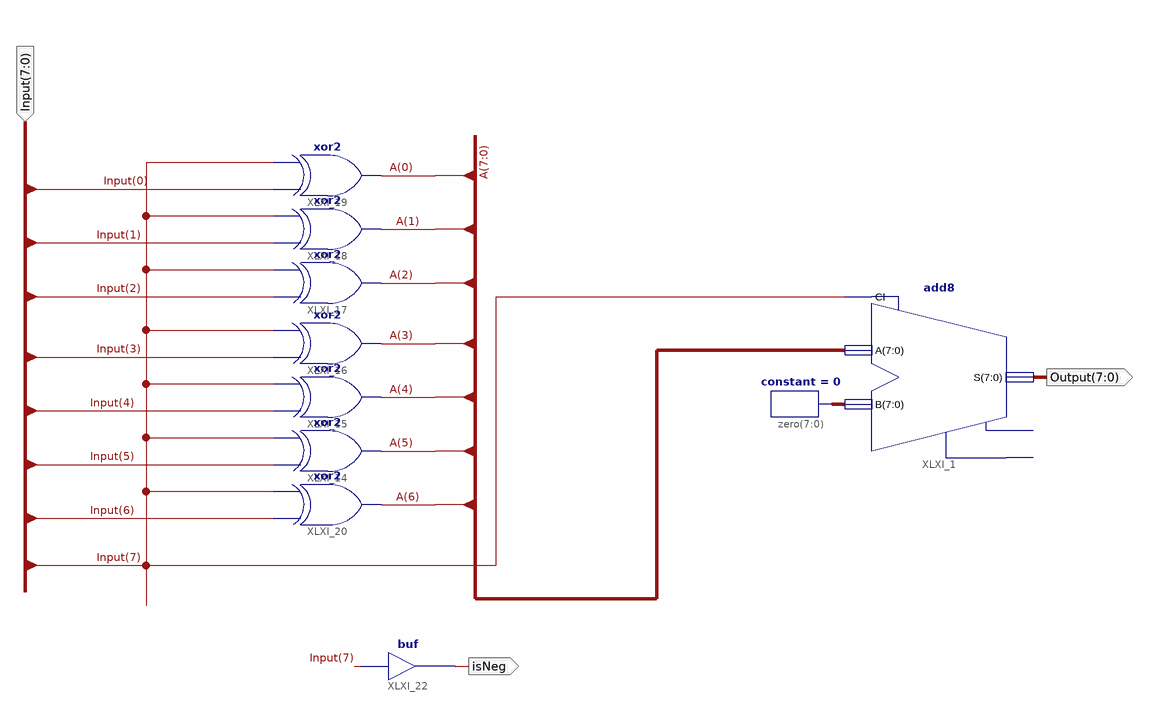
[diagram p0: schematic sheet 1]
// Xilinx ISE schematic twosComp.sch (spartan3e) as structural Verilog: 10 symbols, 3 ports
module twosComp (
  input  [7:0] Input,
  output [7:0] Output,
  output isNeg
);

  wire [7:0] A, XLXN_4;

  constant #(.CValue("0")) zero[7:0] (.O(XLXN_4));
  xor XLXI_14 (A[5], Input[5], Input[7]);
  xor XLXI_15 (A[4], Input[4], Input[7]);
  xor XLXI_16 (A[3], Input[3], Input[7]);
  xor XLXI_17 (A[2], Input[2], Input[7]);
  xor XLXI_18 (A[1], Input[1], Input[7]);
  xor XLXI_19 (A[0], Input[0], Input[7]);
  xor XLXI_20 (A[6], Input[6], Input[7]);
  add8 XLXI_1 (.A(A), .B(XLXN_4), .CI(Input[7]), .S(Output));  // open: CO, OFL
  buf XLXI_22 (isNeg, Input[7]);
endmodule
